# Altium schematic sheet Sheet3.SchDoc
size A; SheetNumber: 3; SheetTotal: 4
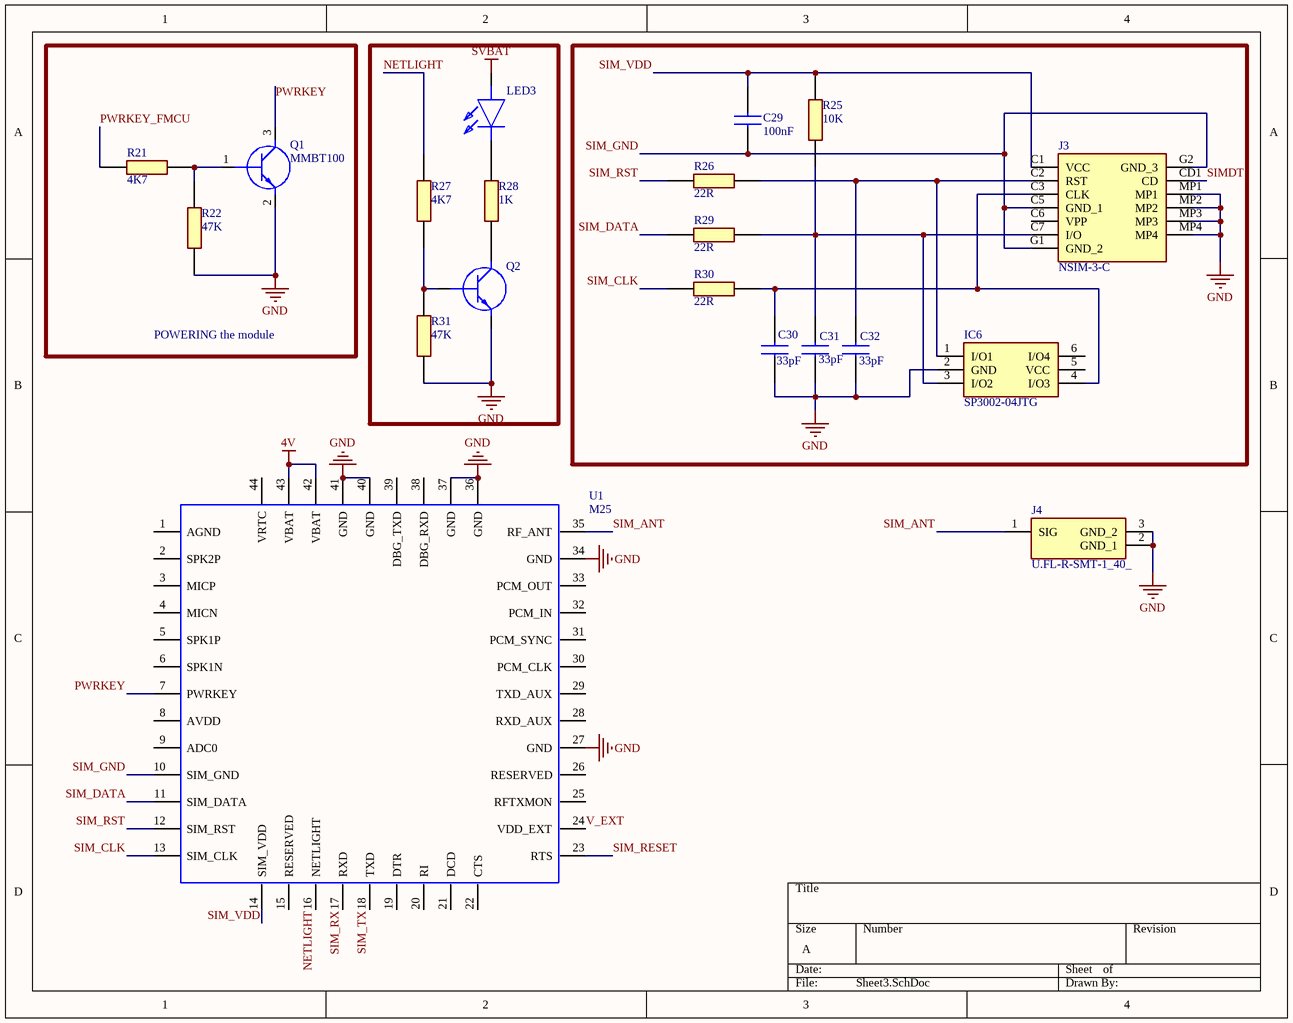
[diagram p0: Sheet3.SchDoc]

## Parts
C29  100nF  [CAPC1608X90N]
C30  33pF  [CAPC0603X33N]
C31  33pF  [CAPC0603X33N]
C32  33pF  [CAPC0603X33N]
IC6  SP3002-04JTG  [SOT65P220X110-6N]
J3  NSIM-3-C  [NSIM3C]
J4  U.FL-R-SMT-1_40_  [UFLRSMT140]
LED3  (no value)  [LEDC1608X80N]
Q1  MMBT100  [SOT96P237X111-3N]
Q2  MMBT100  [SOT96P237X111-3N]  (value not drawn)
R21  4K7  [RESC1608X55N]
R22  47K  [RESC1608X55N]
R25  10K  [RESC2012X60N]
R26  22R  [RESC1608X55N]
R27  4K7  [RESC1608X55N]
R28  1K  [RESC2012X65N]
R29  22R  [RESC1608X55N]
R30  22R  [RESC1608X55N]
R31  47K  [RESC1608X55N]
U1  M25  [PCBComponent_1]

## Blocks framed on the sheet
POWERING the module: Q1 R21 R22

## Nets
4V: U1.42(VBAT) U1.43(VBAT)
GND: C30.1 C31.1 C32.1 IC6.2(GND) J3.MP1 J3.MP2 J3.MP3 J3.MP4 J4.2(GND_1) J4.3(GND_2) Q1.2(E) Q2.2(E) R22.1 R31.1 U1.27(GND) U1.34(GND) U1.36(GND) U1.37(GND) U1.40(GND) U1.41(GND)
SVBAT: LED3.2(A)
NETLIGHT: R27.1 U1.16(NETLIGHT)
PWRKEY: Q1.3(C) U1.7(PWRKEY)
PWRKEY_FMCU: R21.1
SIM_ANT: J4.1(SIG) U1.35(RF_ANT)
SIM_CLK: R30.1 U1.13(SIM_CLK)
SIM_DATA: R29.1 U1.11(SIM_DATA)
SIM_GND: C29.1 J3.C5(GND_1) J3.G1(GND_2) J3.G2(GND_3) U1.10(SIM_GND)
SIM_RESET: U1.23(RTS)
SIM_RST: R26.1 U1.12(SIM_RST)
SIM_RX: U1.17(RXD)
SIM_TX: U1.18(TXD)
SIM_VDD: C29.2 J3.C1(VCC) R25.2 U1.14(SIM_VDD)
SIMDT: J3.CD1(CD)
V_EXT: U1.24(VDD_EXT)
NetC30_2: C30.2 IC6.4(I/O3) J3.C3(CLK) R30.2
NetC31_2: C31.2 IC6.3(I/O2) J3.C7(I/O) R25.1 R29.2
NetC32_2: C32.2 IC6.1(I/O1) J3.C2(RST) R26.2
NetLED3_1: LED3.1(K) R28.2
NetQ1_1: Q1.1(B) R21.2 R22.2
NetQ2_1: Q2.1(B) R27.2 R31.2
NetQ2_3: Q2.3(C) R28.1

Not connected (* = marked no-connect by the designer): IC6 5(VCC) 6(I/O4); J3 C6(VPP); U1 1(AGND) 2(SPK2P) 3(MICP) 4(MICN) 5(SPK1P) 6(SPK1N) 8(AVDD) 9(ADC0) 15(RESERVED) 19(DTR) 20(RI) 21(DCD) 22(CTS) 25(RFTXMON) 26(RESERVED) 28(RXD_AUX) 29(TXD_AUX) 30(PCM_CLK) 31(PCM_SYNC) 32(PCM_IN) 33(PCM_OUT) 38(DBG_RXD) 39(DBG_TXD) 44(VRTC)

## Library data of the parts
C29 = 06036C104MAZ2A: Capacitor; Manufacturer_Name: AVX; Datasheet Link: https://componentsearchengine.com/Datasheets/1/06031A100FAT2A.pdf; Height: 0.9mm; Manufacturer_Part_Number: 06036C104MAZ2A; Mouser Part Number: 581-06036C104MAZ2A; Mouser Price/Stock: https://www.mouser.co.uk/ProductDetail/AVX/06036C104MAZ2A?qs=9g9l2Gjnh0s%2FYval7p6%252B1g%3D%3D; Arrow Part Number: 06036C104MAZ2A; Arrow Price/Stock: https://www.arrow.com/en/products/06036c104maz2a/avx
C30-C32 = GJM0335C0J330JB01D: Capacitor; Manufacturer_Name: Murata Electronics; Datasheet Link: https://datasheet.datasheetarchive.com/originals/distributors/Datasheets_SAMA/1b8ebccddda42a85d5d2941bb85cddb2.pdf; Height: 0.33mm; Manufacturer_Part_Number: GJM0335C0J330JB01D; Mouser Part Number: 81-GJM0335C0J330JB1D; Mouser Price/Stock: https://www.mouser.co.uk/ProductDetail/Murata-Electronics/GJM0335C0J330JB01D?qs=563MOeNa05KY2adUKCPfEg%3D%3D; Arrow Part Number: GJM0335C0J330JB01D; Arrow Price/Stock: https://www.arrow.com/en/products/gjm0335c0j330jb01d/murata-manufacturing
IC6 = SP3002-04JTG: Integrated Circuit; Manufacturer_Name: LITTELFUSE; Datasheet Link: https://m.littelfuse.com/~/media/electronics/datasheets/tvs_diode_arrays/littelfuse_tvs_diode_array_sp3002_datasheet.pdf.pdf; Height: 1.1mm; Manufacturer_Part_Number: SP3002-04JTG; Mouser Part Number: 576-SP3002-04JTG; Mouser Price/Stock: https://www.mouser.co.uk/ProductDetail/Littelfuse/SP3002-04JTG?qs=Xb8IjHhkxj40Q3K%2Fx81Vbw%3D%3D; Arrow Part Number: SP3002-04JTG; Arrow Price/Stock: https://www.arrow.com/en/products/sp3002-04jtg/littelfuse?region=nac
J3 = NSIM-3-C: Connector; Manufacturer_Name: CUI Devices; Datasheet Link: https://www.cuidevices.com/product/resource/pdf/nsim-3-c.pdf; Height: 1.6mm; Manufacturer_Part_Number: NSIM-3-C; Mouser Part Number: 179-NSIM-3-C; Mouser Price/Stock: https://www.mouser.co.uk/ProductDetail/CUI-Devices/NSIM-3-C?qs=Z%252BL2brAPG1Ij16zaFFJpag%3D%3D
J4 = U.FL-R-SMT-1_40_: RF Connectors / Coaxial Connectors SMT MALE RECEPT AU 50 OHM; Manufacturer_Name: Hirose; Manufacturer_Part_Number: U.FL-R-SMT-1(40); Geometry.Height: 1.45mm; Mouser Part Number: 798-UFLRSMT140; Mouser Price/Stock: https://www.mouser.co.uk/ProductDetail/Hirose-Connector/U.FL-R-SMT-140?qs=PABxe4V6HDrVNWAmh6WKgw%3D%3D; Datasheet Link: https://www.arrow.com/en/products/u.fl-r-smt-1-40/hirose-electric
LED3 = 150060YS75000: LED; Manufacturer_Name: Wurth Elektronik; Datasheet Link: http://uk.rs-online.com/web/p/products/8154219; Height: 0.8mm; Manufacturer_Part_Number: 150060YS75000; Mouser Part Number: 710-150060YS75000; Mouser Price/Stock: https://www.mouser.co.uk/ProductDetail/Wurth-Elektronik/150060YS75000?qs=LlUlMxKIyB0nKmwefHgtZw%3D%3D
Q1 Q2 = MMBT100: Transistor BJT NPN; Manufacturer_Name: onsemi; Datasheet Link: https://www.onsemi.com/pub/Collateral/PN100A-D.pdf; Height: 1.11mm; Manufacturer_Part_Number: MMBT100; Mouser Part Number: 512-MMBT100; Mouser Price/Stock: https://www.mouser.co.uk/ProductDetail/onsemi-Fairchild/MMBT100?qs=UMEuL5FsraBwiKQ1WMrjpg%3D%3D; Arrow Part Number: MMBT100; Arrow Price/Stock: https://www.arrow.com/en/products/mmbt100/on-semiconductor?region=nac
R21 R27 = RC0603FR-074K7L: Resistor; Manufacturer_Name: KEMET; Datasheet Link: http://www.yageo.com/documents/recent/PYu-RC0603_51_RoHS_L_v5.pdf; Height: 0.55mm; Manufacturer_Part_Number: RC0603FR-074K7L; Mouser Part Number: 603-RC0603FR-074K7L; Mouser Price/Stock: https://www.mouser.co.uk/ProductDetail/YAGEO/RC0603FR-074K7L?qs=gt6vzsuosg37y0l7Vt36bQ%3D%3D; Arrow Part Number: RC0603FR-074K7L; Arrow Price/Stock: https://www.arrow.com/en/products/rc0603fr-074k7l/yageo?region=europe
R22 R31 = CPF0603B47K5E1: Resistor; Manufacturer_Name: TE Connectivity; Datasheet Link: http://www.farnell.com/datasheets/1786775.pdf; Height: 0.55mm; Manufacturer_Part_Number: CPF0603B47K5E1; Mouser Part Number: 279-CPF0603B47K5E1; Mouser Price/Stock: https://www.mouser.co.uk/ProductDetail/TE-Connectivity-Holsworthy/CPF0603B47K5E1?qs=HLeXuo0aL2pkn%2F2uGrcY6w%3D%3D
R25 = CR0805-FX-1002ELF: Resistor; Manufacturer_Name: Bourns; Datasheet Link: https://www.bourns.com/pdfs/chpreztr.pdf; Height: 0.6mm; Manufacturer_Part_Number: CR0805-FX-1002ELF; Mouser Part Number: 652-CR0805FX-1002ELF; Mouser Price/Stock: https://www.mouser.co.uk/ProductDetail/Bourns/CR0805-FX-1002ELF?qs=tknLyCMIRbPr%252BDD0s0nG9g%3D%3D; Arrow Part Number: CR0805-FX-1002ELF; Arrow Price/Stock: https://www.arrow.com/en/products/cr0805-fx-1002elf/bourns?region=nac
R26 R29 R30 = RC0603FR-0722RL: Resistor; Manufacturer_Name: KEMET; Datasheet Link: http://www.yageo.com/documents/recent/PYu-RC0603_51_RoHS_L_v5.pdf; Height: 0.55mm; Manufacturer_Part_Number: RC0603FR-0722RL; Mouser Part Number: 603-RC0603FR-0722RL; Mouser Price/Stock: https://www.mouser.co.uk/ProductDetail/YAGEO/RC0603FR-0722RL?qs=diQw95jMAeMOsxb8bne7fg%3D%3D
R28 = ACPP0805_1K_B: Resistor; Manufacturer_Name: Ohmite; Manufacturer_Part_Number: ACPP0805 1K B; Datasheet Link: http://www.ohmite.com/assets/docs/acl_acpp.pdf?r=false; Height: 0.65mm; Mouser Part Number: 284-ACPP08051KB; Mouser Price/Stock: https://www.mouser.co.uk/ProductDetail/Ohmite/ACPP0805-1K-B?qs=Zd7iEDjwU0pWc8Q5DTRspw%3D%3D
U1 = M25: Part Description: *; Value: *; Geometry.Height: *; Manufacturer: *; BOMRemark: *; option: *; Part Number: *; PCB DECAL: *